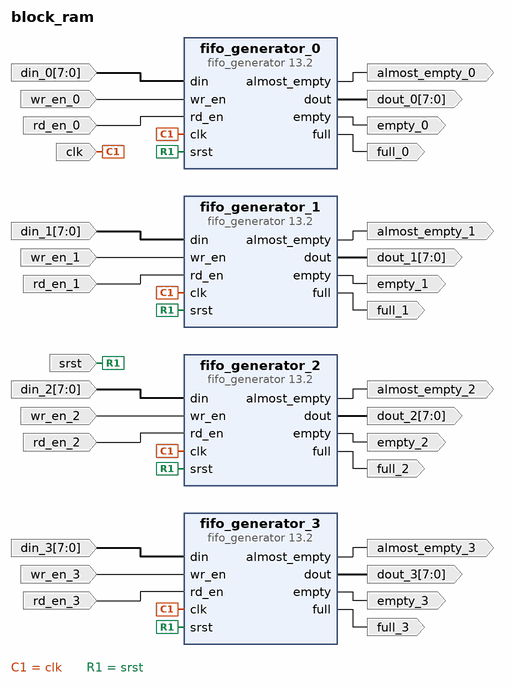
[diagram p0: block diagram of the top level]
# Vivado block design block_ram, xc7z020clg484-1, Vivado 2018.2
create_bd_design block_ram

create_bd_port -dir I -type rst srst
set_property -dict {CONFIG.POLARITY ACTIVE_HIGH} [get_bd_ports srst]
create_bd_port -dir I -type clk clk
create_bd_port -dir O full_0
create_bd_port -dir I -from 7 -to 0 din_0
create_bd_port -dir I wr_en_0
create_bd_port -dir O empty_0
create_bd_port -dir O -from 7 -to 0 dout_0
create_bd_port -dir I rd_en_0
create_bd_port -dir O full_1
create_bd_port -dir I -from 7 -to 0 din_1
create_bd_port -dir I wr_en_1
create_bd_port -dir O empty_1
create_bd_port -dir O -from 7 -to 0 dout_1
create_bd_port -dir I rd_en_1
create_bd_port -dir O full_2
create_bd_port -dir I -from 7 -to 0 din_2
create_bd_port -dir I wr_en_2
create_bd_port -dir O empty_2
create_bd_port -dir O -from 7 -to 0 dout_2
create_bd_port -dir I rd_en_2
create_bd_port -dir O full_3
create_bd_port -dir I -from 7 -to 0 din_3
create_bd_port -dir I wr_en_3
create_bd_port -dir O empty_3
create_bd_port -dir O -from 7 -to 0 dout_3
create_bd_port -dir I rd_en_3
create_bd_port -dir O almost_empty_1
create_bd_port -dir O almost_empty_0
create_bd_port -dir O almost_empty_2
create_bd_port -dir O almost_empty_3

create_bd_cell -type ip -vlnv xilinx.com:ip:fifo_generator:13.2 fifo_generator_0
set_property -dict [list \
  CONFIG.Input_Data_Width 8 \
  CONFIG.Output_Data_Width 8 \
  CONFIG.Use_Embedded_Registers false \
  CONFIG.Reset_Pin true \
  CONFIG.Reset_Type Synchronous_Reset \
  CONFIG.Use_Dout_Reset true \
  CONFIG.Almost_Empty_Flag true \
] [get_bd_cells fifo_generator_0]
create_bd_cell -type ip -vlnv xilinx.com:ip:fifo_generator:13.2 fifo_generator_1
set_property -dict [list \
  CONFIG.Input_Data_Width 8 \
  CONFIG.Output_Data_Width 8 \
  CONFIG.Use_Embedded_Registers false \
  CONFIG.Reset_Pin true \
  CONFIG.Reset_Type Synchronous_Reset \
  CONFIG.Use_Dout_Reset true \
  CONFIG.Almost_Empty_Flag true \
] [get_bd_cells fifo_generator_1]
create_bd_cell -type ip -vlnv xilinx.com:ip:fifo_generator:13.2 fifo_generator_2
set_property -dict [list \
  CONFIG.Input_Data_Width 8 \
  CONFIG.Output_Data_Width 8 \
  CONFIG.Use_Embedded_Registers false \
  CONFIG.Reset_Pin true \
  CONFIG.Reset_Type Synchronous_Reset \
  CONFIG.Use_Dout_Reset true \
  CONFIG.Almost_Empty_Flag true \
] [get_bd_cells fifo_generator_2]
create_bd_cell -type ip -vlnv xilinx.com:ip:fifo_generator:13.2 fifo_generator_3
set_property -dict [list \
  CONFIG.Input_Data_Width 8 \
  CONFIG.Output_Data_Width 8 \
  CONFIG.Use_Embedded_Registers false \
  CONFIG.Reset_Pin true \
  CONFIG.Reset_Type Synchronous_Reset \
  CONFIG.Use_Dout_Reset true \
  CONFIG.Almost_Empty_Flag true \
] [get_bd_cells fifo_generator_3]

# ---- connections ----

connect_bd_net [get_bd_ports clk] \
  [get_bd_pins fifo_generator_0/clk] [get_bd_pins fifo_generator_2/clk] [get_bd_pins fifo_generator_1/clk] \
  [get_bd_pins fifo_generator_3/clk]
connect_bd_net [get_bd_pins fifo_generator_0/full] [get_bd_ports full_0]
connect_bd_net -net din_0_1 [get_bd_ports din_0] [get_bd_pins fifo_generator_0/din]
connect_bd_net -net wr_en_0_1 [get_bd_ports wr_en_0] [get_bd_pins fifo_generator_0/wr_en]
connect_bd_net [get_bd_pins fifo_generator_0/empty] [get_bd_ports empty_0]
connect_bd_net [get_bd_pins fifo_generator_0/dout] [get_bd_ports dout_0]
connect_bd_net -net rd_en_0_1 [get_bd_ports rd_en_0] [get_bd_pins fifo_generator_0/rd_en]
connect_bd_net [get_bd_pins fifo_generator_1/full] [get_bd_ports full_1]
connect_bd_net -net din_1_1 [get_bd_ports din_1] [get_bd_pins fifo_generator_1/din]
connect_bd_net -net wr_en_1_1 [get_bd_ports wr_en_1] [get_bd_pins fifo_generator_1/wr_en]
connect_bd_net [get_bd_pins fifo_generator_1/empty] [get_bd_ports empty_1]
connect_bd_net [get_bd_pins fifo_generator_1/dout] [get_bd_ports dout_1]
connect_bd_net -net rd_en_1_1 [get_bd_ports rd_en_1] [get_bd_pins fifo_generator_1/rd_en]
connect_bd_net [get_bd_pins fifo_generator_2/full] [get_bd_ports full_2]
connect_bd_net -net din_2_1 [get_bd_ports din_2] [get_bd_pins fifo_generator_2/din]
connect_bd_net -net wr_en_2_1 [get_bd_ports wr_en_2] [get_bd_pins fifo_generator_2/wr_en]
connect_bd_net [get_bd_pins fifo_generator_2/empty] [get_bd_ports empty_2]
connect_bd_net [get_bd_pins fifo_generator_2/dout] [get_bd_ports dout_2]
connect_bd_net -net rd_en_2_1 [get_bd_ports rd_en_2] [get_bd_pins fifo_generator_2/rd_en]
connect_bd_net [get_bd_pins fifo_generator_3/full] [get_bd_ports full_3]
connect_bd_net -net din_3_1 [get_bd_ports din_3] [get_bd_pins fifo_generator_3/din]
connect_bd_net -net wr_en_3_1 [get_bd_ports wr_en_3] [get_bd_pins fifo_generator_3/wr_en]
connect_bd_net [get_bd_pins fifo_generator_3/empty] [get_bd_ports empty_3]
connect_bd_net [get_bd_pins fifo_generator_3/dout] [get_bd_ports dout_3]
connect_bd_net -net rd_en_3_1 [get_bd_ports rd_en_3] [get_bd_pins fifo_generator_3/rd_en]
connect_bd_net [get_bd_pins fifo_generator_1/almost_empty] [get_bd_ports almost_empty_1]
connect_bd_net [get_bd_pins fifo_generator_0/almost_empty] [get_bd_ports almost_empty_0]
connect_bd_net [get_bd_pins fifo_generator_2/almost_empty] [get_bd_ports almost_empty_2]
connect_bd_net [get_bd_pins fifo_generator_3/almost_empty] [get_bd_ports almost_empty_3]
connect_bd_net [get_bd_ports srst] \
  [get_bd_pins fifo_generator_1/srst] [get_bd_pins fifo_generator_3/srst] [get_bd_pins fifo_generator_2/srst] \
  [get_bd_pins fifo_generator_0/srst]

validate_bd_design
save_bd_design
